# Altium schematic sheet ESP32.SchDoc
size A; SheetNumber: 4; SheetTotal: 4
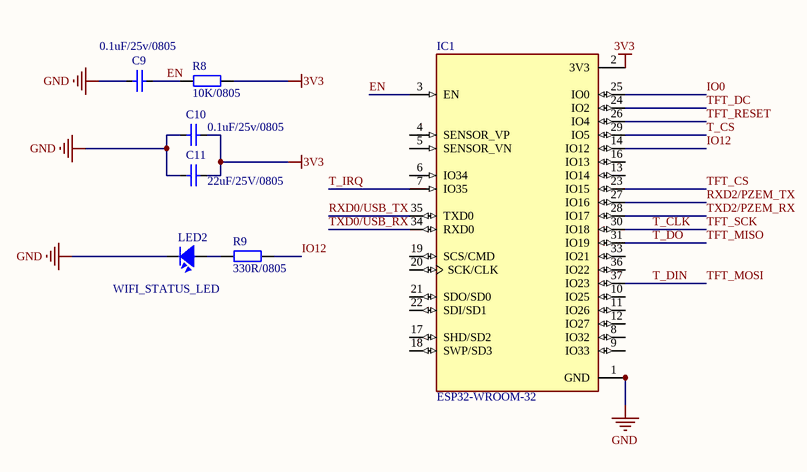
[diagram p0: ESP32.SchDoc]

## Parts
C9  0.1uF/25v/0805  [CAP_0805]
C10  0.1uF/25v/0805  [CAP_0805]
C11  22uF/25V/0805  [CAP_0805]
IC1  ESP32-WROOM-32  [MODULE_ESP32-WROOM-32]
LED2  WIFI_STATUS_LED  [LED-3]
R8  10K/0805  [RES-SMD-0805]
R9  330R/0805  [RES-SMD-0101]

## Nets
3V3: C10.2 C11.2 IC1.2(3V3) R8.2
GND: C9.1 C10.1 C11.1 IC1.1(GND) IC1.15(GND) IC1.38(GND) IC1.39_1(GND) IC1.39_2(GND) IC1.39_3(GND) IC1.39_4(GND) IC1.39_5(GND) IC1.39_6(GND) IC1.39_7(GND) IC1.39_8(GND) IC1.39_9(GND) IC1.39_10(GND) IC1.39_11(GND) IC1.39_12(GND) IC1.39_13(GND) IC1.39_14(GND) IC1.39_15(GND) IC1.39_16(GND) IC1.39_17(GND) IC1.39_18(GND) IC1.39_19(GND) IC1.39_20(GND) IC1.39_21(GND) LED2.2
EN: C9.2 IC1.3(EN) R8.1
IO0: IC1.25(IO0)
IO12: IC1.14(IO12) R9.1
RXD0/USB_TX: IC1.35(TXD0)
RXD2/PZEM_TX: IC1.27(IO16)
T_CLK: IC1.30(IO18)  [also labelled TFT_SCK]
T_CS: IC1.29(IO5)
T_DIN: IC1.37(IO23)  [also labelled TFT_MOSI]
T_DO: IC1.31(IO19)  [also labelled TFT_MISO]
T_IRQ: IC1.7(IO35)
TFT_CS: IC1.23(IO15)
TFT_DC: IC1.24(IO2)
TFT_RESET: IC1.26(IO4)
TXD0/USB_RX: IC1.34(RXD0)
TXD2/PZEM_RX: IC1.28(IO17)
NetLED2_1: LED2.1 R9.2

Not connected (* = marked no-connect by the designer): IC1 4(SENSOR_VP) 5(SENSOR_VN) 6(IO34) 8(IO32) 9(IO33) 10(IO25) 11(IO26) 12(IO27) 13(IO14) 16(IO13) 17(SHD/SD2) 18(SWP/SD3) 19(SCS/CMD) 20(SCK/CLK) 21(SDO/SD0) 22(SDI/SD1) 33(IO21) 36(IO22)

## Library data of the parts
C9-C11 = CapSMD: Capacitor; Value: 33p; Published: 8-Jun-2000; LatestRevisionDate: 17-Jul-2002; LatestRevisionNote: Re-released for DXP Platform.; PackageReference: RAD-0.3; Publisher: Altium Limited
IC1 = ESP32-WROOM-32: Bluetooth, WiFi Transceiver Module 2.4GHz ~ 2.5GHz Surface Mount; MF: Espressif Systems; Package: Module Espressif Systems; Digi-Key_Part_Number: 1904-1010-1-ND; Digi-Key_Purchase_URL: https://www.digikey.com/product-detail/en/espressif-systems/ESP32-WROOM-32/1904-1010-1-ND/8544305?utm_source=snapeda&utm_medium=aggregator&utm_campaign=symbol; Value: *; MP: ESP32-WROOM-32; SnapEDA_Link: https://www.snapeda.com/parts/ESP32-WROOM-32/Espressif%20Systems/view-part/2753322/?ref=snap
LED2 = LED: LED Single colour Green and Red; Value: LED 3 ly Single Colour
R8 R9 = Resistor - SMD: Resistor SMD; Manufacturer: Generic Components; Class: Passive; Published: 08/06/2000; Publisher: Altium Hobart Technology Centre